# Altium schematic sheet STM32F103VCT61_STM32F103VCT6 (1).schdoc
size 124 x 139 mm
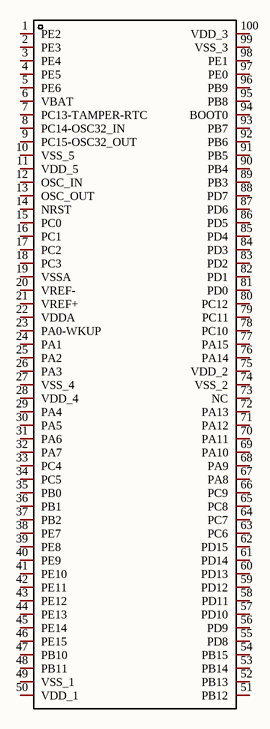
[diagram p0: STM32F103VCT61_STM32F103VCT6 (1).schdoc]

## Parts
U?  STM32F103VCT6  [LQFP-100_L14.0-W14.0-P0.50-LS16.0-BL]  (value not drawn)

## Nets

Not connected (* = marked no-connect by the designer): U? 1(PE2) 2(PE3) 3(PE4) 4(PE5) 5(PE6) 6(VBAT) 7(PC13-TAMPER-RTC) 8(PC14-OSC32_IN) 9(PC15-OSC32_OUT) 10(VSS_5) 11(VDD_5) 12(OSC_IN) 13(OSC_OUT) 14(NRST) 15(PC0) 16(PC1) 17(PC2) 18(PC3) 19(VSSA) 20(VREF-) 21(VREF+) 22(VDDA) 23(PA0-WKUP) 24(PA1) 25(PA2) 26(PA3) 27(VSS_4) 28(VDD_4) 29(PA4) 30(PA5) 31(PA6) 32(PA7) 33(PC4) 34(PC5) 35(PB0) 36(PB1) 37(PB2) 38(PE7) 39(PE8) 40(PE9) 41(PE10) 42(PE11) 43(PE12) 44(PE13) 45(PE14) 46(PE15) 47(PB10) 48(PB11) 49(VSS_1) 50(VDD_1) 51(PB12) 52(PB13) 53(PB14) 54(PB15) 55(PD8) 56(PD9) 57(PD10) 58(PD11) 59(PD12) 60(PD13) 61(PD14) 62(PD15) 63(PC6) 64(PC7) 65(PC8) 66(PC9) 67(PA8) 68(PA9) 69(PA10) 70(PA11) 71(PA12) 72(PA13) 73(NC) 74(VSS_2) 75(VDD_2) 76(PA14) 77(PA15) 78(PC10) 79(PC11) 80(PC12) 81(PD0) 82(PD1) 83(PD2) 84(PD3) 85(PD4) 86(PD5) 87(PD6) 88(PD7) 89(PB3) 90(PB4) 91(PB5) 92(PB6) 93(PB7) 94(BOOT0) 95(PB8) 96(PB9) 97(PE0) 98(PE1) 99(VSS_3) 100(VDD_3)

## Library data of the parts
U? = STM32F103VCT6: Manufacturer: ST(意法半导体); Add into BOM: yes; UART/USART: 3 USART+2 UART; SPI: 3; USB Device: 1; PWM: 18; LCD: LCD parallel interface, 8080/6800 modes; I2C（SMBUS/PMBUS）: 2; Voltage - Supply (Vcc/Vdd): 2V ~ 3.6V; A/D: 16x12bit; D/A: 2x12bit; Program Memory Size: 256KB; RAM Size: 48KB; Speed: 72MHz; Number of I/O: 80; Name: STM32F103VCT6; Symbol: STM32F103VCT6; Device: STM32F103VCT6; LCSC Part Name: STM32F103VCT6; Supplier Part: C8313; Manufacturer Part: STM32F103VCT6; Supplier Footprint: LQFP-100_14x14x05P; JLCPCB Part Class: Basic Part; Datasheet: https://atta.szlcsc.com/upload/public/pdf/source/20140724/1457707170946.pdf; Supplier: LCSC; Convert to PCB: yes; CAN: 1